# EAGLE schematic CadSoftElectronic (EAGLE 7.7.0)
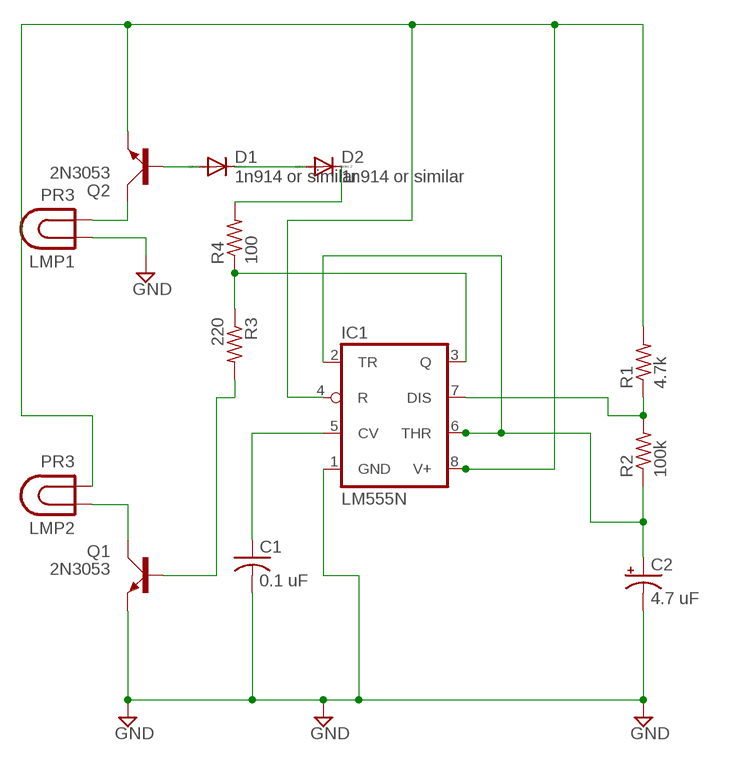
[diagram p0: schematic, sheet 1]

## Parts
C1  0.1 uF  C-US050-025X075  [C050-025X075]
C2  4.7 uF  CPOL-USE5-5  [E5-5]
D1  1n914 or similar  DIODE-D-2.5  [D-2.5]
D2  1n914 or similar  DIODE-D-2.5  [D-2.5]
IC1  LM555N  [DIL08]
LMP1  PR3  LAMP  [LDH-5R]
LMP2  PR3  LAMP  [LDH-5R]
Q1  2N3053  [TO39]
Q2  2N3053  [TO39]
R1  4.7k  R-US_0207/2V  [0207/2V]
R2  100k  R-US_0207/2V  [0207/2V]
R3  220  R-US_0207/2V  [0207/2V]
R4  100  R-US_0207/2V  [0207/2V]

## Nets
GND: C1.2 C2.- IC1.1(GND) LMP1.1 Q1.1(E)
N$1: IC1.4(R) IC1.8(V+) LMP2.2 Q2.1(E) R1.2
N$2: LMP2.1 Q1.3(C)
N$3: IC1.7(DIS) R1.1 R2.2
N$4: C2.+ IC1.2(TR) IC1.6(THR) R2.1
N$5: C1.1 IC1.5(CV)
N$6: D1.C D2.A
N$7: D2.C R4.2
N$8: IC1.3(Q) R3.1 R4.1
N$9: LMP1.2 Q2.3(C)
N$10: D1.A Q2.2(B)
N$11: Q1.2(B) R3.2

## Library data of the parts
C1 = resistor:C-US: CAPACITOR, American symbol
C2 = rcl:CPOL-US: POLARIZED CAPACITOR, American symbol
D1 D2 = diode:DIODE-: DIODE
IC1 = linear:*555: TIMER
LMP1 LMP2 = special:LAMP: LED HOLDER
Q1 Q2 = transistor-small-signal:2N3053: NPN TRANSISTOR
R1-R4 = rcl:R-US_: RESISTOR, American symbol